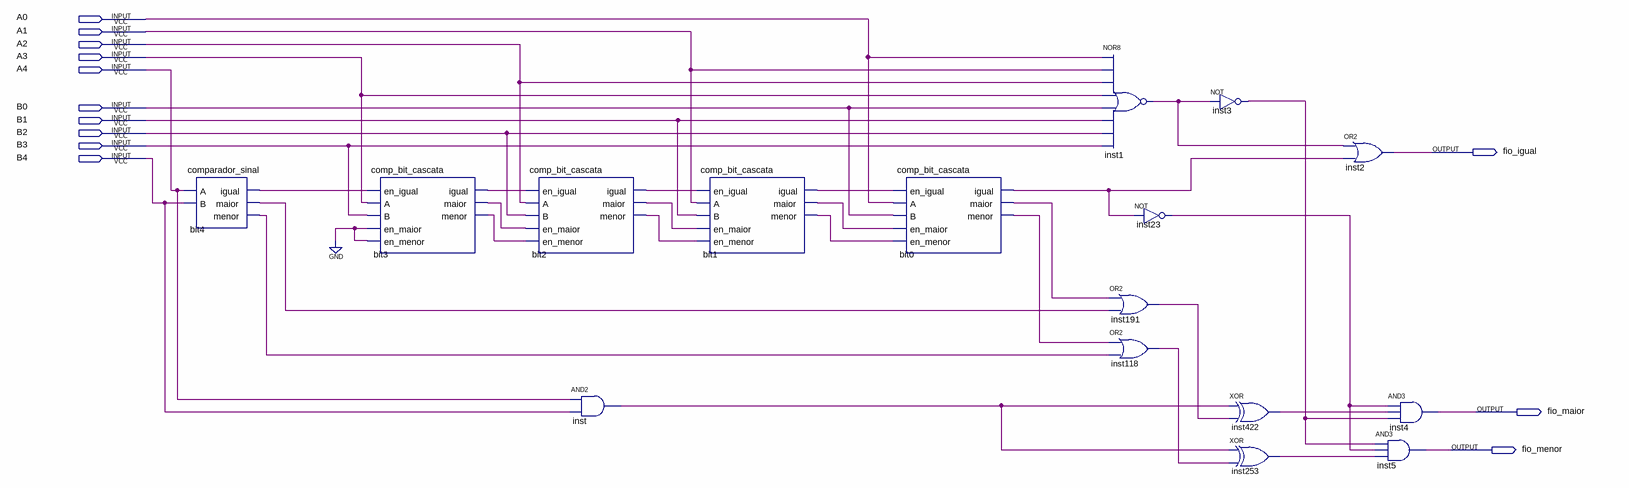
[diagram p0: schematic sheet]
// Quartus schematic comparadores_ULA.bdf as structural Verilog: 16 symbols, 13 pins
module comparadores_ULA (
  input  A0,
  input  A1,
  input  A2,
  input  A3,
  input  A4,
  input  B0,
  input  B1,
  input  B2,
  input  B3,
  input  B4,
  output fio_igual,
  output fio_maior,
  output fio_menor
);

  wire bit0_igual, bit0_maior, bit0_menor, bit1_igual, bit1_maior, bit1_menor, bit2_igual, bit2_maior,
       bit2_menor, bit3_igual, bit3_maior, bit3_menor, bit4_igual, bit4_maior, bit4_menor, inst1_out,
       inst3_out, inst23_out, inst118_out, inst191_out, inst253_out, inst422_out, inst_out;

  comparador_sinal bit4 (.A(A4), .B(B4), .igual(bit4_igual), .maior(bit4_maior), .menor(bit4_menor));
  comp_bit_cascata bit3 (
    .en_igual(bit4_igual), .A(A3), .B(B3), .en_maior(1'b0), .en_menor(1'b0), .igual(bit3_igual),
    .maior(bit3_maior), .menor(bit3_menor));
  comp_bit_cascata bit2 (
    .en_igual(bit3_igual), .A(A2), .B(B2), .en_maior(bit3_maior), .en_menor(bit3_menor), .igual(bit2_igual),
    .maior(bit2_maior), .menor(bit2_menor));
  and inst (inst_out, A4, B4);
  comp_bit_cascata bit1 (
    .en_igual(bit2_igual), .A(A1), .B(B1), .en_maior(bit2_maior), .en_menor(bit2_menor), .igual(bit1_igual),
    .maior(bit1_maior), .menor(bit1_menor));
  comp_bit_cascata bit0 (
    .en_igual(bit1_igual), .A(A0), .B(B0), .en_maior(bit1_maior), .en_menor(bit1_menor), .igual(bit0_igual),
    .maior(bit0_maior), .menor(bit0_menor));
  nor inst1 (inst1_out, A0, A1, A2, A3, B0, B1, B2, B3);
  or inst191 (inst191_out, bit0_maior, bit4_maior);
  or inst118 (inst118_out, bit0_menor, bit4_menor);
  not inst23 (inst23_out, bit0_igual);
  not inst3 (inst3_out, inst1_out);
  xor inst422 (inst422_out, inst_out, inst191_out);
  xor inst253 (inst253_out, inst_out, inst118_out);
  or inst2 (fio_igual, inst1_out, bit0_igual);
  and inst4 (fio_maior, inst23_out, inst422_out, inst3_out);
  and inst5 (fio_menor, inst3_out, inst23_out, inst253_out);
endmodule
